# EasyEDA schematic RejsaCAN v2.5 - Schematic.json
TITLE: RejsaCAN; REV: 2.5; Date: 2022-10-28; Sheet: 1/1; Drawn By: MagnusT
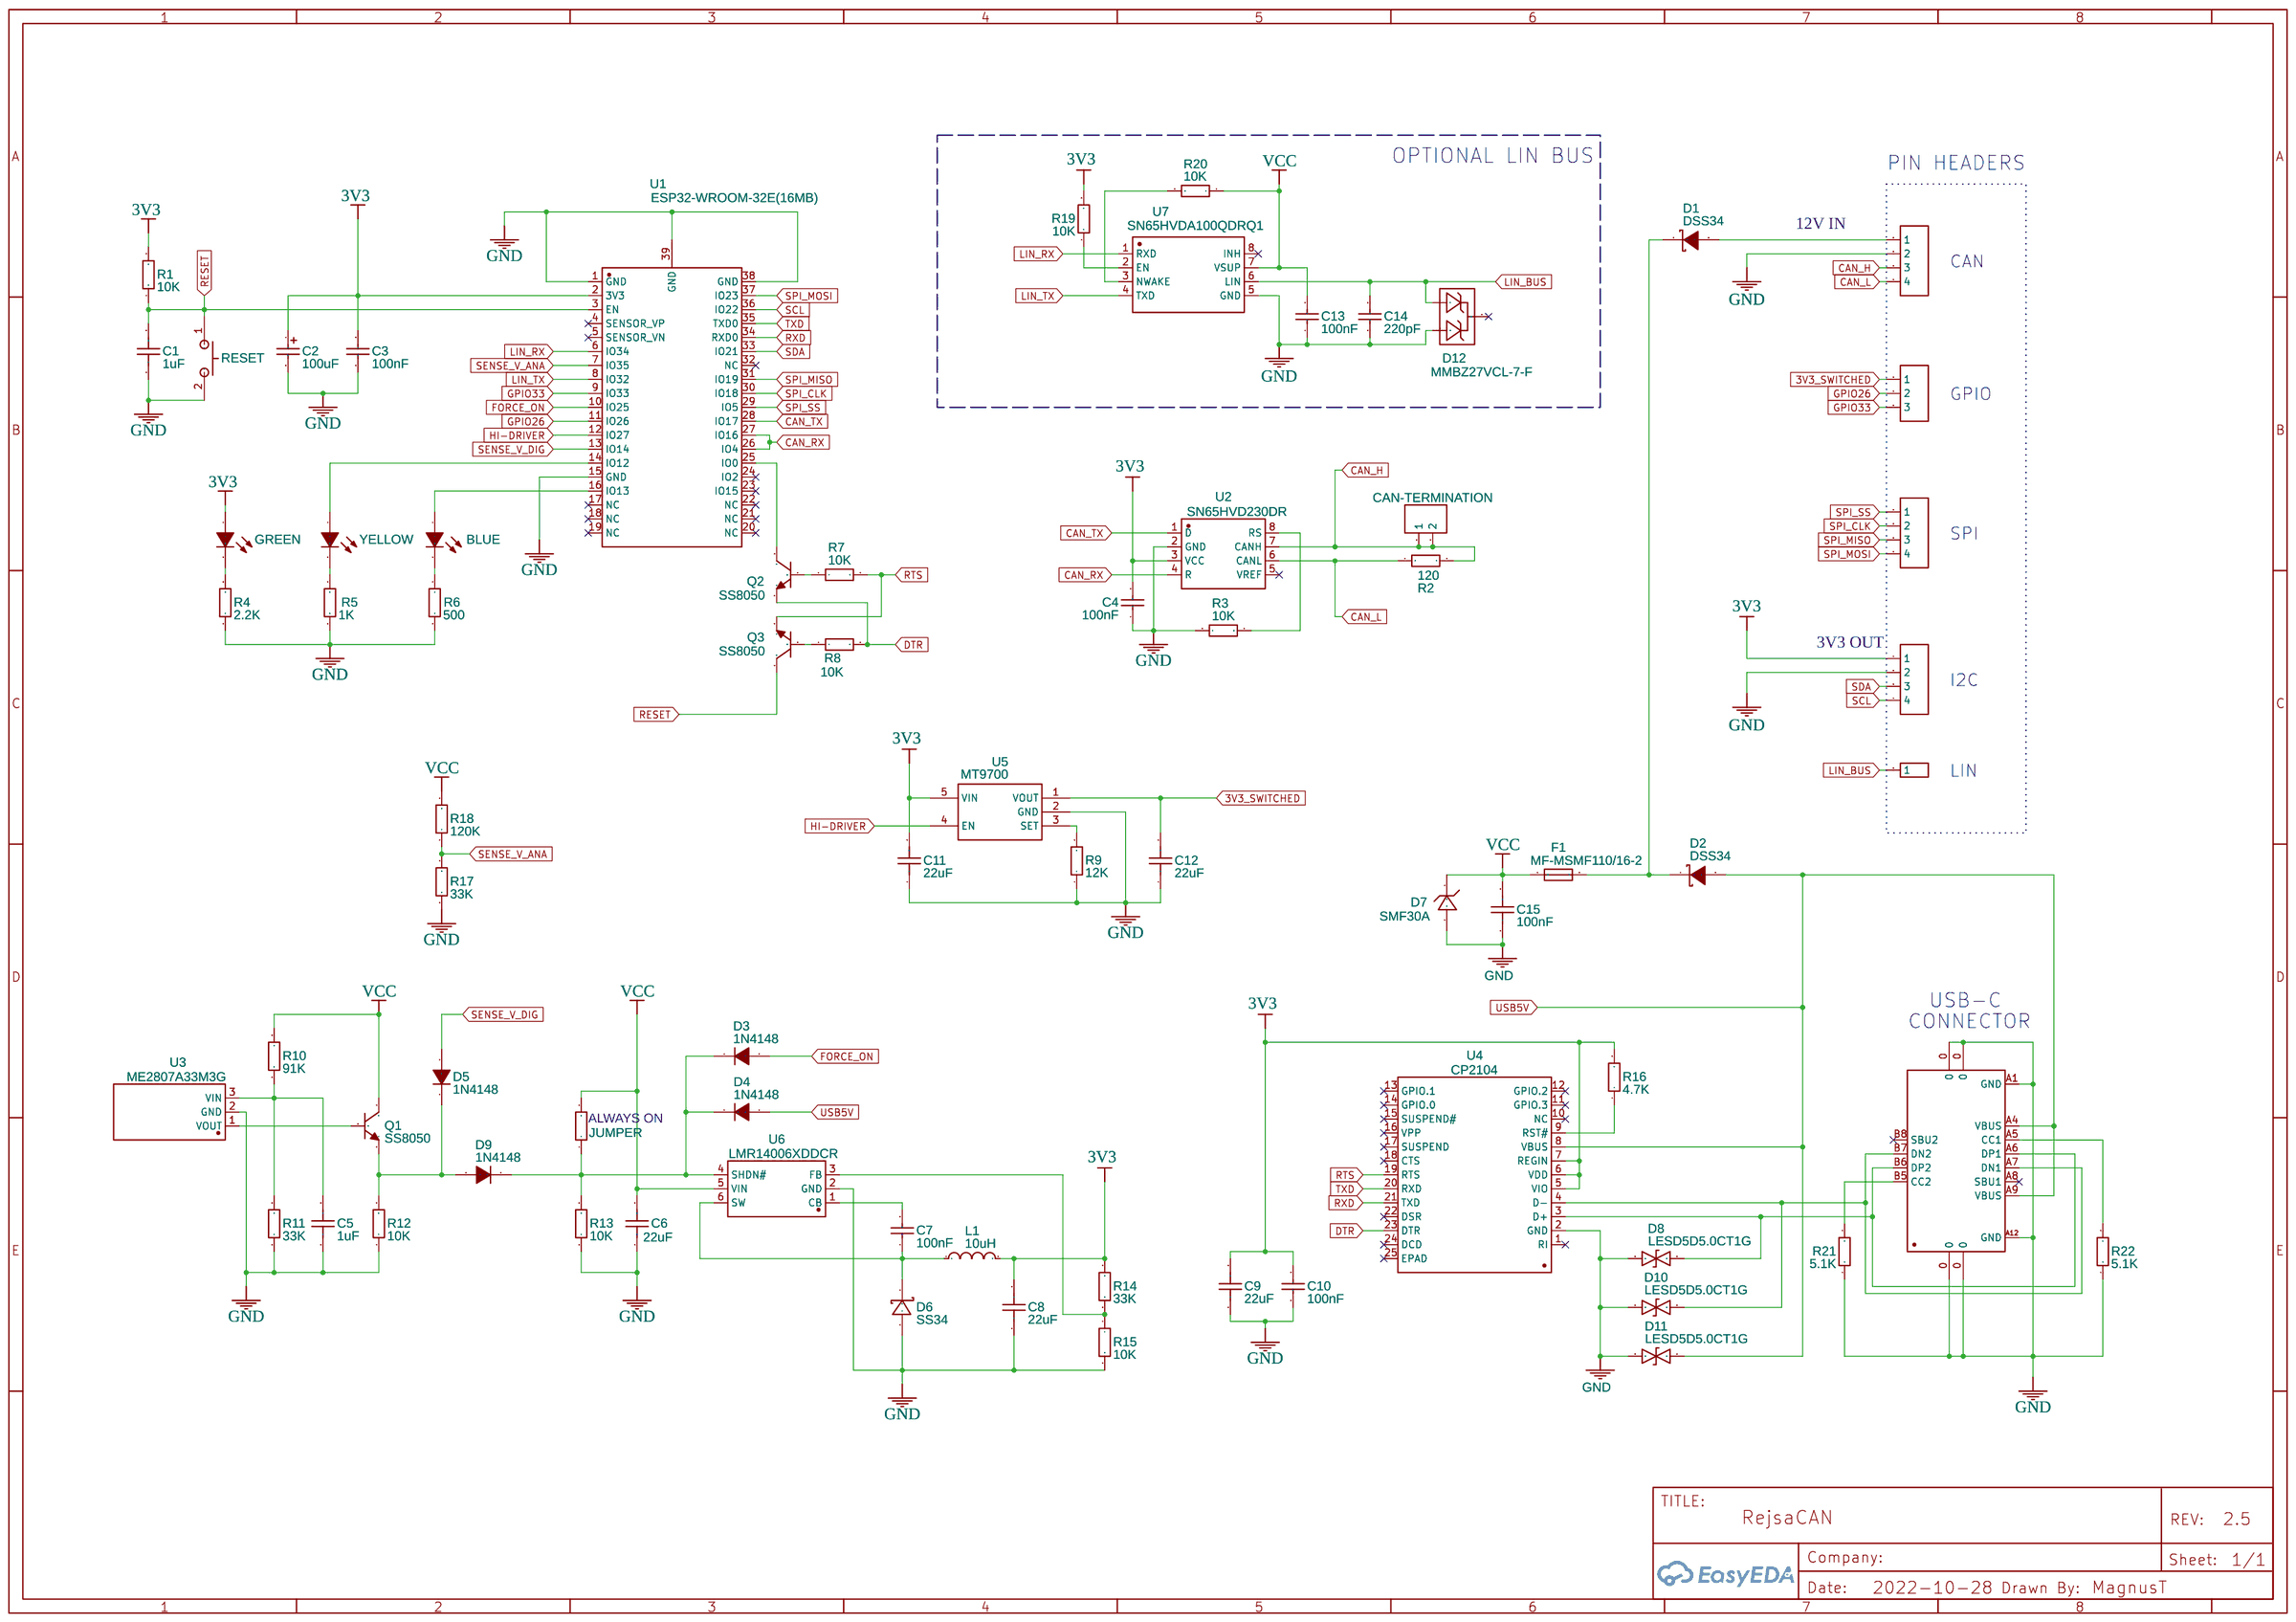
[diagram p0: schematic sheet]

## Parts
BLUE  19-217/BHC-ZL1M2RY/3T  [LED0603-R-RD]
C1  1uF  [C0402]
C2  100uF  [CAP-SMD_L3.5-W2.8]
C3  100nF  [C0402_NEW]
C4  100nF  [C0402_NEW]
C5  1uF  [C0402]
C6  22uF  [C0805]
C7  100nF  [C0402_NEW]
C8  22uF  [C0603]
C9  22uF  [C0603]
C10  100nF  [C0402_NEW]
C11  22uF  [C0603]
C12  22uF  [C0603]
C13  100nF  [C0402_NEW]
C14  220pF  [C0402]
C15  100nF  [C0402]
CAN-TERMINATION  HDR-M-2.54_1x2  [HDR-M-2.54_1X2]
D1  DSS34  [SOD-123_L2.8-W1.8-LS3.7-RD]
D2  DSS34  [SOD-123_L2.8-W1.8-LS3.7-RD]
D3  1N4148  [SOD-323_L1.8-W1.3-LS2.5-RD]
D4  1N4148  [SOD-323_L1.8-W1.3-LS2.5-RD]
D5  1N4148  [SOD-323_L1.8-W1.3-LS2.5-RD]
D6  SS34  [DO-214AC_L4.3-W2.7-LS5.3-RD]
D7  SMF30A  [SOD-123_L2.8-W1.8-LS3.7-RD]
D8  LESD5D5.0CT1G  [SOD-523_L1.2-W0.8-LS1.6-BI]
D9  1N4148  [SOD-323_L1.8-W1.3-LS2.5-RD]
D10  LESD5D5.0CT1G  [SOD-523_L1.2-W0.8-LS1.6-BI]
D11  LESD5D5.0CT1G  [SOD-523_L1.2-W0.8-LS1.6-BI]
D12  MMBZ27VCL-7-F  [SOT-23-3_L2.9-W1.3-P1.90-LS2.4-BR]
F1  MF-MSMF110/16-2  [F1812]
GREEN  19-217/GHC-YR1S2/3T  [LED0603-R-RD]
J1  HDR-M-2.54_1x4  [HDR-M-2.54_1X4]
J2  HDR-M-2.54_1x4  [HDR-M-2.54_1X4]
J3  HDR-M-2.54_1x4  [HDR-M-2.54_1X4]
J4  HDR-M-2.54_1x3  [HDR-M-2.54_1X3]
J5  HDR-M-2.54_1x1  [HDR-M-2.54_1X1]
JUMPER  -  [R0402]
L1  10uH  [IND-SMD_L6.0-W6.0_SLP6028S]
Q1  SS8050  [SOT-23-3_L2.9-W1.3-P1.90-LS2.4-BR]
Q2  SS8050  [SOT-23-3_L2.9-W1.3-P1.90-LS2.4-BR]
Q3  SS8050  [SOT-23-3_L2.9-W1.3-P1.90-LS2.4-BR]
R1  10K  [R0402]
R2  120  [R1206]
R3  10K  [R0402]
R4  2.2K  [R0402]
R5  1K  [R0402]
R6  500  [R0402]
R7  10K  [R0402]
R8  10K  [R0402]
R9  12K  [R0402]
R10  91K  [R0402]
R11  33K  [R0402]
R12  10K  [R0402]
R13  10K  [R0402]
R14  33K  [R0402]
R15  10K  [R0402]
R16  4.7K  [R0402]
R17  33K  [R0402]
R18  120K  [R0402]
R19  10K  [R0402]
R20  10K  [R0402]
R21  5.1K  [R0402]
R22  5.1K  [R0402]
RESET  GT-TC029B-H025-L1N  [SW-SMD_L3.9-W2.9-P4.15-LS5.0]
U1  ESP32-WROOM-32E(16MB)  [WIFI-SMD_ESP32-WROOM-32E]
U2  SN65HVD230DR  [SOIC-8_L4.9-W3.9-P1.27-LS6.0-BL]
U3  ME2807A33M3G  [SOT-23_L2.9-W1.3-P1.90-LS2.4-BR]
U4  CP2104  [QFN-24_L4.0-W4.0-P0.50-BL-EP2.7]
U5  MT9700  [SOT-23-5_L3.0-W1.7-P0.95-LS2.8-BR]
U6  LMR14006XDDCR  [TSOT-23-6_L2.9-W1.6-P0.95-LS2.8-BL]
U7  SN65HVDA100QDRQ1  [SOIC-8_L4.9-W3.9-P1.27-LS6.0-BL]
USB-C  USB3.1C16PFSMT  [USB-C-SMD_TYPE-C-USB-17]
YELLOW  19-213/Y2C-CQ2R2L/3T(CY)  [LED0603-R-RD]

## Library data of the parts
BLUE = 19-217/BHC-ZL1M2RY/3T: Supplier: LCSC; Manufacturer: EVERLIGHT; Supplier Part: C72041; JLCPCB Part Class: Basic Part; Package Display: No
C1 C5 = CL05A105KA5NQNC: Supplier: LCSC; Manufacturer: SAMSUNG; Supplier Part: C52923; JLCPCB Part Class: Basic Part; Package Display: No
C2 = TAJB107K006RNJ: Supplier: LCSC; Manufacturer: AVX; Supplier Part: C16133; JLCPCB Part Class: Basic Part; Package Display: No
C3 C4 C7 C10 C13 = CL05B104KO5NNNC: Supplier: LCSC; Manufacturer: SAMSUNG; Supplier Part: C1525; JLCPCB Part Class: Basic Part; Package Display: No
C6 = CL21A226MAYNNNE: Supplier: LCSC; Supplier Part: C602037; Manufacturer: Samsung Electro-Mechanics; Contributor: LCSC; JLCPCB Part Class: Extended Part
C8 C9 C11 C12 = CL10A226MQ8NRNC: Supplier: LCSC; Manufacturer: SAMSUNG; Supplier Part: C59461; JLCPCB Part Class: Basic Part; Package Display: No
C14 = 0402B221K500NT: Supplier: LCSC; Manufacturer: FH; Supplier Part: C1530; JLCPCB Part Class: Basic Part
C15 = CL05B104KB54PNC: Supplier: LCSC; Supplier Part: C307331; Manufacturer: Samsung Electro-Mechanics; Contributor: LCSC; JLCPCB Part Class: Basic Part
CAN-TERMINATION = HDR-M-2.54_1x2: Supplier Part: C124375; Supplier: LCSC; Contributor: LCEDA_Lib; Package Display: No
D1 D2 = DSS34: Supplier: LCSC; Manufacturer: STARSEA; Supplier Part: C84632; JLCPCB Part Class: Extended Part
D3-D5 D9 = 1N4148WS T4: Supplier: LCSC; Manufacturer: CJ; Supplier Part: C2128; JLCPCB Part Class: Basic Part; Package Display: No
D6 = SS34_C8678: Supplier: LCSC; Manufacturer: MDD; Supplier Part: C8678; JLCPCB Part Class: Basic Part; Package Display: No
D7 = SMF30A_C366558: Supplier: LCSC; Supplier Part: C366558; Manufacturer: DOWO; Contributor: LCSC; JLCPCB Part Class: Extended Part
D8 D10 D11 = LESD5D5.0CT1G: Supplier: LCSC; Supplier Part: C383211; Manufacturer: Leshan Radio; Contributor: LCSC; JLCPCB Part Class: Extended Part
D12 = MMBZ27VCL-7-F: Supplier: LCSC; Supplier Part: C698227; Manufacturer: Diodes Incorporated; Contributor: LCSC; JLCPCB Part Class: Extended Part
F1 = MF-MSMF110/16-2: Supplier: LCSC; Supplier Part: C210834; Manufacturer: BOURNS; Contributor: LCSC; JLCPCB Part Class: Extended Part
GREEN = 19-217/GHC-YR1S2/3T: Supplier: LCSC; Manufacturer: EVERLIGHT; Supplier Part: C72043; JLCPCB Part Class: Basic Part; Package Display: No
J1-J3 = HDR-M-2.54_1x4: Supplier Part: C124378; Supplier: LCSC; Contributor: LCEDA_Lib; Package Display: No
J4 = HDR-M-2.54_1x3: Supplier Part: C180248; Supplier: LCSC; Contributor: LCEDA_Lib; Package Display: No
J5 = HDR-M-2.54_1x1: Supplier Part: C81276; Supplier: LCSC; Contributor: LCEDA_Lib
JUMPER = 0402WGF3092TCE: Contributor: LCSC
L1 = SLP6028S100MTT: Supplier: LCSC; Supplier Part: C254862; Manufacturer: Sunltech Tech; Contributor: LCSC; JLCPCB Part Class: Extended Part
Q1-Q3 = SS8050_C2150: Supplier: LCSC; Manufacturer: CJ; Supplier Part: C2150; JLCPCB Part Class: Basic Part; Package Display: No
R1 R3 R7 R8 R12 R13 R15 R19 R20 = 0402WGF1002TCE: Supplier: LCSC; Manufacturer: UniOhm; Supplier Part: C25744; JLCPCB Part Class: Basic Part; Package Display: No
R2 = RTT061200FTP: Supplier: LCSC; Manufacturer: RALEC; Contributor: LCSC; Supplier Part: C159715; JLCPCB Part Class: Extended Part; Package Display: No
R4 = 0402WGF2201TCE: Supplier: LCSC; Manufacturer: UniOhm; Supplier Part: C25879; JLCPCB Part Class: Basic Part; Package Display: No
R5 = 0402WGF1001TCE: Supplier: LCSC; Manufacturer: UniOhm; Supplier Part: C11702; JLCPCB Part Class: Basic Part; Package Display: No
R6 = 0402WGF1001TCE: Supplier: LCSC; Manufacturer: UniOhm; Manufacturer Part: 0402WGF4700TCE; Supplier Part: C25117; JLCPCB Part Class: Basic Part; Package Display: No
R9 = 0402WGF1202TCE: Supplier: LCSC; Manufacturer: UniOhm; Supplier Part: C25752; JLCPCB Part Class: Basic Part
R10 = 0402WGF9102TCE: Supplier: LCSC; Manufacturer: UniOhm; Supplier Part: C4147; JLCPCB Part Class: Extended Part
R11 R14 R17 = 0402WGF3302TCE: Supplier: LCSC; Manufacturer: UniOhm; Supplier Part: C25779; JLCPCB Part Class: Basic Part
R16 = 0402WGF4701TCE: Supplier: LCSC; Manufacturer: UniOhm; Supplier Part: C25900; JLCPCB Part Class: Basic Part; Package Display: No
R18 = 0402WGF1203TCE: Supplier: LCSC; Manufacturer: UniOhm; Supplier Part: C25750; JLCPCB Part Class: Basic Part
R21 R22 = 0402WGF5101TCE: Supplier: LCSC; Manufacturer: UniOhm; Supplier Part: C25905; JLCPCB Part Class: Basic Part
RESET = GT-TC029B-H025-L1N: Supplier: LCSC; Supplier Part: C843669; Manufacturer: G-Switch; Contributor: LCSC; JLCPCB Part Class: Extended Part; Package Display: No
U1 = ESP32-WROOM-32E(16MB): Supplier: LCSC; Supplier Part: C701343; Manufacturer: Espressif Systems; Contributor: LCSC; JLCPCB Part Class: Extended Part
U2 = SN65HVD230DR: Supplier: LCSC; Manufacturer: TI; Supplier Part: C12084; JLCPCB Part Class: Basic Part; Package Display: No
U3 = ME2807A33M3G: Supplier: LCSC; Supplier Part: C236755; Manufacturer: Nanjing Micro One Elec; Contributor: LCSC; JLCPCB Part Class: Extended Part
U4 = CP2104-F03-GM: Supplier: LCSC; Manufacturer: SILICON LABS; Supplier Part: C47742; JLCPCB Part Class: Basic Part; Package Display: No
U5 = MT9700: Supplier: LCSC; Manufacturer: AEROSEMI; Supplier Part: C89855; JLCPCB Part Class: Extended Part
U6 = LMR14006XDDCR: Supplier: LCSC; Supplier Part: C478074; Manufacturer: Texas Instruments; Contributor: LCSC; JLCPCB Part Class: Extended Part
U7 = SN65HVDA100QDRQ1: Supplier: LCSC; Manufacturer: TI; Supplier Part: C138300; JLCPCB Part Class: Extended Part
USB-C = USB3.1C16PFSMT: Supplier: LCSC; Supplier Part: C167321; Manufacturer: LCSC; Contributor: LCSC; JLCPCB Part Class: Extended Part; Package Display: No
YELLOW = 19-213/Y2C-CQ2R2L/3T(CY): Supplier: LCSC; Manufacturer: EVERLIGHT; Supplier Part: C72038; JLCPCB Part Class: Basic Part; Package Display: No

## Nets
3V3: C2.1 C3.2 C4.2 C8.2 C9.2 C10.2 C11.2 GREEN.1(A) J2.1 L1.2 R1.2 R14.2 R16.2 R19.2 U1.2(3V3) U2.3(VCC) U4.5(VIO) U4.6(VDD) U4.7(REGIN) U5.5(VIN)
3V3_SWITCHED: C12.2 J4.1 U5.1(VOUT)
GND: C1.1 C2.2 C3.1 C4.1 C5.1 C6.1 C8.1 C9.1 C10.1 C11.1 C12.1 C13.1 C14.1 C15.1 D6.2(A) D7.2 D8.2 D10.2 D11.2 D12.2 J1.2 J2.2 R3.1 R4.1 R5.2 R6.2 R9.1 R11.1 R12.1 R13.1 R15.2 R17.1 R21.1 R22.1 RESET.2 U1.1(GND) U1.15(GND) U1.38(GND) U1.39(GND) U2.2(GND) U3.2(GND) U4.2(GND) U5.2(GND) U6.2(GND) U7.5(GND) USB-C.0 USB-C.A1(GND) USB-C.A12(GND)
VCC: C6.2 C13.2 C15.2 D7.1 F1.1 JUMPER.2 Q1.3(C) R10.2 R18.2 R20.1 U6.5(VIN) U7.7(VSUP)
CAN_H: CAN-TERMINATION.1 CAN-TERMINATION.2 J1.3 R2.2 U2.7(CANH)
CAN_L: J1.4 R2.1 U2.6(CANL)
CAN_RX: U1.26(IO4) U1.27(IO16) U2.4(R)
CAN_TX: U1.28(IO17) U2.1(D)
DTR: Q2.2(E) R8.2 U4.23(DTR)
FORCE_ON: D3.2(A) U1.10(IO25)
GPIO26: J4.2 U1.11(IO26)
GPIO33: J4.3 U1.9(IO33)
HI-DRIVER: U1.12(IO27) U5.4(EN)
LIN_BUS: C14.2 D12.1 J5.1 U7.6(LIN)
LIN_RX: U1.6(IO34) U7.1(RXD)
LIN_TX: U1.8(IO32) U7.4(TXD)
RESET: C1.2 Q3.3(C) R1.1 RESET.1 U1.3(EN)
RTS: Q3.2(E) R7.2 U4.19(RTS)
RXD: U1.34(RXD0) U4.21(TXD)
SCL: J2.4 U1.36(IO22)
SDA: J2.3 U1.33(IO21)
SENSE_V_ANA: R17.2 R18.1 U1.7(IO35)
SENSE_V_DIG: D5.2(A) U1.13(IO14)
SPI_CLK: J3.2 U1.30(IO18)
SPI_MISO: J3.3 U1.31(IO19)
SPI_MOSI: J3.4 U1.37(IO23)
SPI_SS: J3.1 U1.29(IO5)
TXD: U1.35(TXD0) U4.20(RXD)
USB5V: D2.2(A) D4.2(A) D11.1 U4.8(VBUS) USB-C.A4(VBUS) USB-C.A9(VBUS)
Net-(BLUE-1): BLUE.1(A) U1.16(IO13)
Net-(BLUE-2): BLUE.2(C) R6.1
Net-(C5-2): C5.2 R10.1 R11.2 U3.3(VIN)
Net-(C7-1): C7.1 D6.1(K) L1.1 U6.6(SW)
Net-(C7-2): C7.2 U6.1(CB)
Net-(D1-1): D1.1(K) D2.1(K) F1.2
Net-(D1-2): D1.2(A) J1.1
Net-(D3-1): D3.1(K) D4.1(K) D9.1(K) JUMPER.1 R13.2 U6.4(SHDN#)
Net-(D5-1): D5.1(K) D9.2(A) Q1.2(E) R12.2
Net-(D8-1): D8.1 U4.3(D+) USB-C.A6(DP1) USB-C.B6(DP2)
Net-(D10-1): D10.1 U4.4(D-) USB-C.A7(DN1) USB-C.B7(DN2)
Net-(GREEN-2): GREEN.2(C) R4.2
Net-(Q1-1): Q1.1(B) U3.1(VOUT)
Net-(Q2-1): Q2.1(B) R7.1
Net-(Q2-3): Q2.3(C) U1.25(IO0)
Net-(Q3-1): Q3.1(B) R8.1
Net-(R3-2): R3.2 U2.8(RS)
Net-(R5-1): R5.1 YELLOW.2(C)
Net-(R9-2): R9.2 U5.3(SET)
Net-(R14-1): R14.1 R15.1 U6.3(FB)
Net-(R16-1): R16.1 U4.9(RST#)
Net-(R19-1): R19.1 U7.2(EN)
Net-(R20-2): R20.2 U7.3(NWAKE)
Net-(R21-2): R21.2 USB-C.B5(CC2)
Net-(R22-2): R22.2 USB-C.A5(CC1)
Net-(U1-14): U1.14(IO12) YELLOW.1(A)

Not connected (* = marked no-connect by the designer): D12 3*; U1 4(SENSOR_VP)* 5(SENSOR_VN)* 17(NC)* 18(NC)* 19(NC)* 20(NC)* 21(NC)* 22(NC)* 23(IO15)* 24(IO2)* 32(NC)*; U2 5(VREF)*; U4 1(RI)* 10(NC)* 11(GPIO.3)* 12(GPIO.2)* 13(GPIO.1)* 14(GPIO.0)* 15(SUSPEND#)* 16(VPP)* 17(SUSPEND)* 18(CTS)* 22(DSR)* 24(DCD)* 25(EPAD)*; U7 8(INH)*; USB-C A8(SBU1)* B8(SBU2)*

## Notes on the sheet
- OPTIONAL LIN BUS
- PIN HEADERS
- 12V IN
- CAN
- GPIO
- SPI
- 3V3 OUT
- I2C
- LIN
- USB-C
- CONNECTOR
- ALWAYS ON
